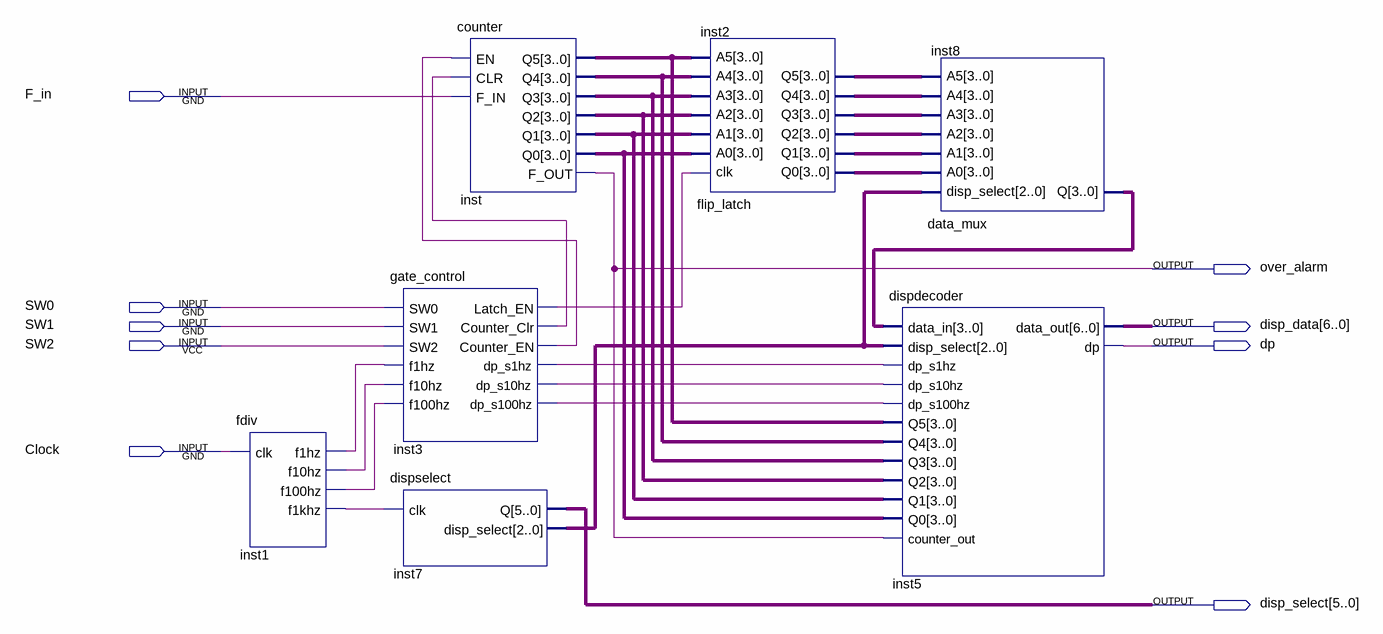
[diagram p0: schematic sheet]
// Quartus schematic main.bdf as structural Verilog: 7 symbols, 9 pins
module main (
  input  F_in,
  input  SW0,
  input  SW1,
  input  SW2,
  input  Clock,
  output over_alarm,
  output [6:0] disp_data,
  output dp,
  output [5:0] disp_select
);

  wire inst1_f1hz, inst1_f1khz, inst1_f10hz, inst1_f100hz, inst3_counter_clr, inst3_counter_en,
       inst3_dp_s1hz, inst3_dp_s10hz, inst3_dp_s100hz, inst3_latch_en;
  wire [2:0] inst7_disp_select;
  wire [3:0] inst2_q0, inst2_q1, inst2_q2, inst2_q3, inst2_q4, inst2_q5, inst8_q, inst_q0, inst_q1, inst_q2,
       inst_q3, inst_q4, inst_q5;

  fdiv inst1 (.clk(Clock), .f1hz(inst1_f1hz), .f10hz(inst1_f10hz), .f100hz(inst1_f100hz), .f1khz(inst1_f1khz));
  gate_control inst3 (
    .SW0(SW0), .SW1(SW1), .SW2(SW2), .f1hz(inst1_f1hz), .f10hz(inst1_f10hz), .f100hz(inst1_f100hz),
    .Latch_EN(inst3_latch_en), .Counter_Clr(inst3_counter_clr), .Counter_EN(inst3_counter_en),
    .dp_s1hz(inst3_dp_s1hz), .dp_s10hz(inst3_dp_s10hz), .dp_s100hz(inst3_dp_s100hz));
  dispselect inst7 (.clk(inst1_f1khz), .Q(disp_select), .disp_select(inst7_disp_select));
  counter inst (
    .EN(inst3_counter_en), .CLR(inst3_counter_clr), .F_IN(F_in), .Q5(inst_q5), .Q4(inst_q4), .Q3(inst_q3),
    .Q2(inst_q2), .Q1(inst_q1), .Q0(inst_q0), .F_OUT(over_alarm));
  flip_latch inst2 (
    .clk(inst3_latch_en), .A0(inst_q0), .A1(inst_q1), .A2(inst_q2), .A3(inst_q3), .A4(inst_q4), .A5(inst_q5),
    .Q0(inst2_q0), .Q1(inst2_q1), .Q2(inst2_q2), .Q3(inst2_q3), .Q4(inst2_q4), .Q5(inst2_q5));
  dispdecoder inst5 (
    .data_in(inst8_q), .disp_select(inst7_disp_select), .dp_s1hz(inst3_dp_s1hz), .dp_s10hz(inst3_dp_s10hz),
    .dp_s100hz(inst3_dp_s100hz), .Q5(inst_q5), .Q4(inst_q4), .Q3(inst_q3), .Q2(inst_q2), .Q1(inst_q1),
    .Q0(inst_q0), .counter_out(over_alarm), .data_out(disp_data), .dp(dp));
  data_mux inst8 (
    .disp_select(inst7_disp_select), .A0(inst2_q0), .A1(inst2_q1), .A2(inst2_q2), .A3(inst2_q3),
    .A4(inst2_q4), .A5(inst2_q5), .Q(inst8_q));
endmodule
